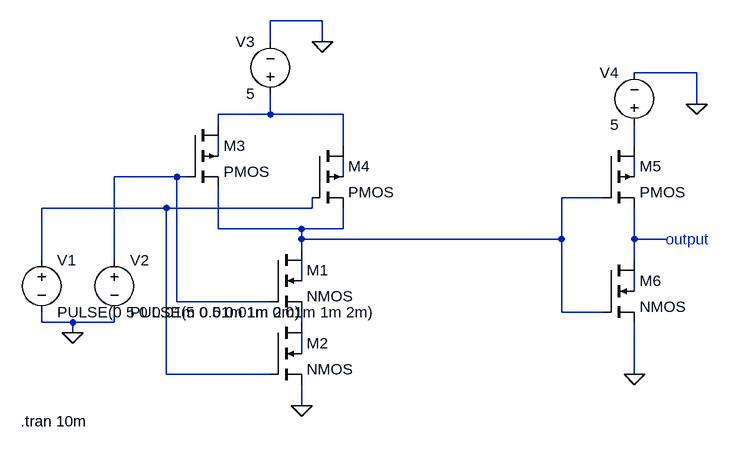
[diagram p0: schematic andgate.asc]
andgate.asc, the LTspice schematic file:
Version 4
SHEET 1 880 680
WIRE 256 -208 176 -208
WIRE 176 -176 176 -208
WIRE 256 -176 256 -208
WIRE 832 -128 736 -128
WIRE 832 -80 832 -128
WIRE 176 -64 176 -96
WIRE 176 -64 96 -64
WIRE 288 -64 176 -64
WIRE 96 -48 96 -64
WIRE 288 -16 288 -64
WIRE 736 -16 736 -48
WIRE 96 0 96 -32
WIRE 32 32 -64 32
WIRE 48 32 32 32
WIRE 288 32 288 0
WIRE 736 32 736 0
WIRE 688 64 624 64
WIRE 16 80 -176 80
WIRE 240 80 240 64
WIRE 240 80 16 80
WIRE 96 112 96 48
WIRE 224 112 96 112
WIRE 288 112 288 80
WIRE 288 112 224 112
WIRE 224 128 224 112
WIRE 624 128 624 64
WIRE 624 128 224 128
WIRE 736 128 736 80
WIRE 784 128 736 128
WIRE 224 144 224 128
WIRE -176 160 -176 80
WIRE -64 160 -64 32
WIRE 736 160 736 128
WIRE 224 192 224 160
WIRE 736 208 736 176
WIRE 32 224 32 32
WIRE 176 224 32 224
WIRE 624 240 624 128
WIRE 688 240 624 240
WIRE -176 256 -176 240
WIRE -128 256 -176 256
WIRE -64 256 -64 240
WIRE -64 256 -128 256
WIRE 224 256 224 240
WIRE -128 272 -128 256
WIRE 224 304 224 272
WIRE 16 336 16 80
WIRE 176 336 16 336
WIRE 736 336 736 256
WIRE 224 384 224 352
FLAG -128 272 0
FLAG 224 384 0
FLAG 256 -176 0
FLAG 736 336 0
FLAG 832 -80 0
SYMBOL nmos4 176 144 R0
SYMATTR InstName M1
SYMBOL nmos4 176 256 R0
SYMATTR InstName M2
SYMBOL pmos4 240 -16 R0
SYMATTR InstName M4
SYMBOL voltage -176 144 R0
WINDOW 123 0 0 Left 0
WINDOW 39 0 0 Left 0
SYMATTR InstName V1
SYMATTR Value PULSE(0 5 0 0.01m 0.01m 1m 2m)
SYMBOL voltage -64 144 R0
WINDOW 123 0 0 Left 0
WINDOW 39 0 0 Left 0
SYMATTR InstName V2
SYMATTR Value PULSE(5 0 5 0.01m 0.01m 1m 2m)
SYMBOL pmos4 48 -48 R0
SYMATTR InstName M3
SYMBOL voltage 176 -80 R180
WINDOW 0 24 96 Left 2
WINDOW 3 24 16 Left 2
WINDOW 123 0 0 Left 0
WINDOW 39 0 0 Left 0
SYMATTR InstName V3
SYMATTR Value 5
SYMBOL pmos4 688 -16 R0
SYMATTR InstName M5
SYMBOL nmos4 688 160 R0
SYMATTR InstName M6
SYMBOL voltage 736 -32 R180
WINDOW 0 24 96 Left 2
WINDOW 3 24 16 Left 2
WINDOW 123 0 0 Left 0
WINDOW 39 0 0 Left 0
SYMATTR InstName V4
SYMATTR Value 5
TEXT -208 408 Left 2 !.tran 10m
TEXT 784 128 Left 2 ;output

The netlist it stands for:
* andgate.asc
M1 N007 N004 N012 N010 NMOS
M2 N012 N008 0 N013 NMOS
M4 N001 N008 N007 N005 PMOS
V1 N008 0 PULSE(0 5 0 0.01m 0.01m 1m 2m)
V2 N004 0 PULSE(5 0 5 0.01m 0.01m 1m 2m)
M3 N001 N004 N007 N003 PMOS
V3 N001 0 5
M5 N002 N007 N009 N006 PMOS
M6 N009 N007 0 N011 NMOS
V4 N002 0 5
.model NMOS NMOS
.model PMOS PMOS
.lib standard.mos
.tran 10m
* output
.backanno
.end